# EAGLE design 6WP_arduino_DFPlayer (EAGLE 9.4.0)
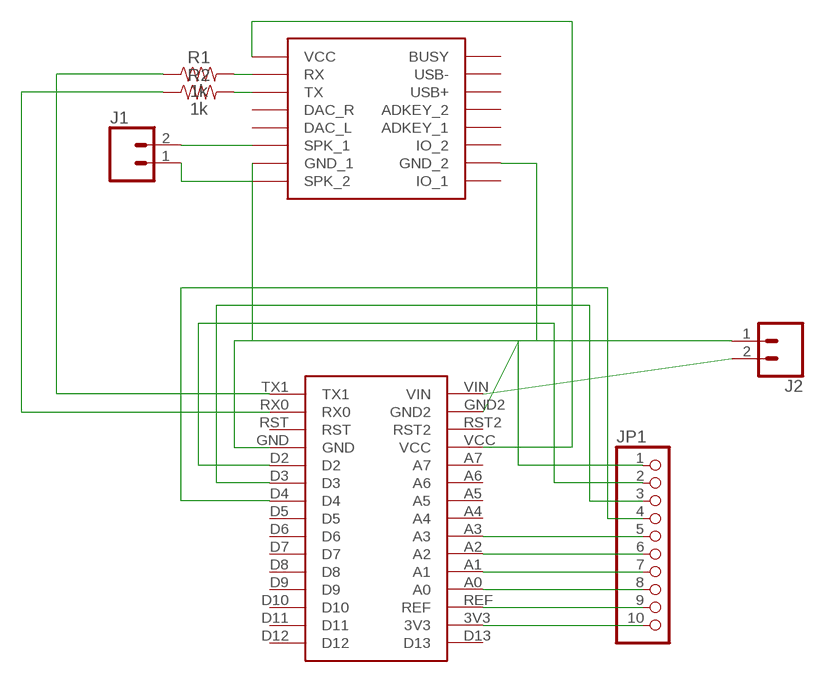
[diagram p0: schematic, sheet 1]

## Parts
A3  ARDUINONANO  [ARDUINONANO]
J1  CONN_02JST-PTH-2  [JST-2-PTH]
J2  CONN_02JST-PTH-2  [JST-2-PTH]
JP1  PINHD-1X10/90  [1X10/90]
R1  1k  1KOHM-HORIZ-1/4W-1%  [AXIAL-0.3]
R2  1k  1KOHM-HORIZ-1/4W-1%  [AXIAL-0.3]
U$1  DFPLAYER  [DFPLAYER]

## Nets
3V3: A3.3V3 JP1.10
A0: A3.A0 JP1.8
A1: A3.A1 JP1.7
A2: A3.A2 JP1.6
A3: A3.A3 JP1.5
D2: A3.D2 JP1.2
D3: A3.D3 JP1.3
D4: A3.D4 JP1.4
GND: A3.GND A3.GND2 J2.1 JP1.1 U$1.GND_1 U$1.GND_2
N$2: J1.2 U$1.SPK1(SPK_1)
N$3: J1.1 U$1.SPK2(SPK_2)
N$4: A3.VIN J2.2
N$16: R1.P$2 U$1.RX
N$21: A3.RX0 R2.P$1
N$22: A3.TX1 R1.P$1
N$23: R2.P$2 U$1.TX
N$27: A3.VCC U$1.VCC
REF: A3.REF JP1.9
Unconnected: A3.A4 A3.A5 A3.A6 A3.A7 A3.D5 A3.D6 A3.D7 A3.D8 A3.D9 A3.D10 A3.D11 A3.D12 A3.D13 A3.RST A3.RST2 U$1.ADKEY1(ADKEY_1) U$1.ADKEY2(ADKEY_2) U$1.BUSY U$1.DAC_L U$1.DAC_R U$1.IO1(IO_1) U$1.IO2(IO_2) U$1.USB+ U$1.USB-

## Library data of the parts
A3 = Arduino Nano:ARDUINONANO
J1 J2 = SparkFun-Connectors:CONN_02: Multi connection point. Often used as Generic Header-pin footprint for 0.1 inch spaced/style header connections On any of the 0.1 inch spaced packages, you can populate with these: Break Away Headers - Straight <https://www.sparkfun.com/products/116> (PRT-00116) Break Away Male Headers - Right Angle <https://www.sparkfun.com/products/553> (PRT-00553) Female Headers <https://www.sparkfun.com/products/115> (PRT-00115) Break Away Headers - Machine Pin <https://www.sparkfun.com/products/117> (PRT-00117) Break Away Female Headers - Swiss Machine Pin <https://www.sparkfun.com/products/743> (PRT-00743) For SCREWTERMINALS and SPRING TERMINALS visit here: Screw Terimnals on SparkFun.com <https://www.sparkfun.com/search/results?term=Screw+Terminals> (5mm/3.5mm/2.54mm spacing) This device is also useful as a general connection point to wire up your design to another part of your project. Our various solder wires solder well into these plated through hole pads. Hook-Up Wire - Assortment (Stranded, 22 AWG) <https://www.sparkfun.com/products/11375> (PRT-11375) Hook-Up Wire - Assortment (Solid Core, 22 AWG) <https://www.sparkfun.com/products/11367> (PRT-11367) View the entire wire category on our website here <https://www.sparkfun.com/categories/141> Special notes: Molex polarized connector foot print use with: PRT-08233 with associated crimp pins and housings. 2.54_SCREWTERM for use with PRT-10571. 3.5mm Screw Terminal footprints for PRT-08084 5mm Screw Terminal footprints for use with PRT-08432; PROD_ID: CONN-09863; SKU: PRT-09914
JP1 = pinhead:PINHD-1X10: PIN HEADER
R1 R2 = SparkFun-Resistors:1KOHM: 1kΩ resistor A resistor is a passive two-terminal electrical component that implements electrical resistance as a circuit element. Resistors act to reduce current flow, and, at the same time, act to lower voltage levels within circuits. - Wikipedia; PROD_ID: RES-12182
U$1 = DFPlayer_v1:DFPLAYER

## Board
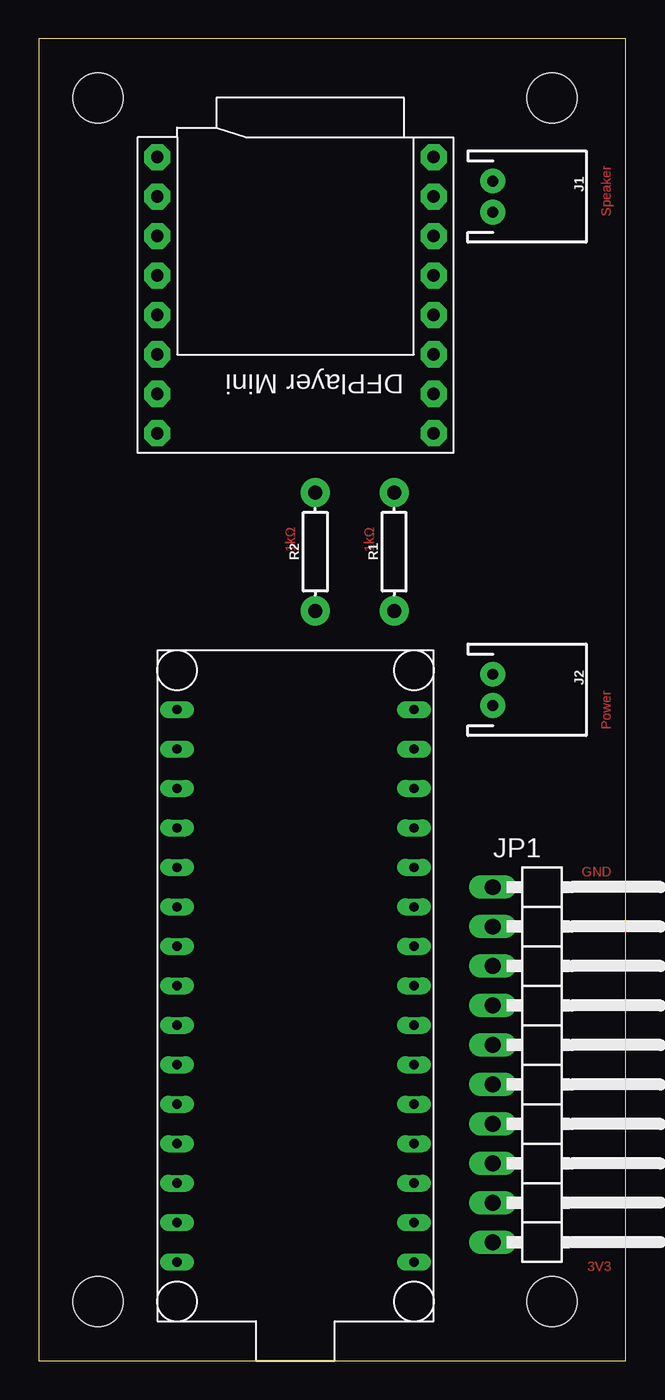
[diagram p1: board, top side]
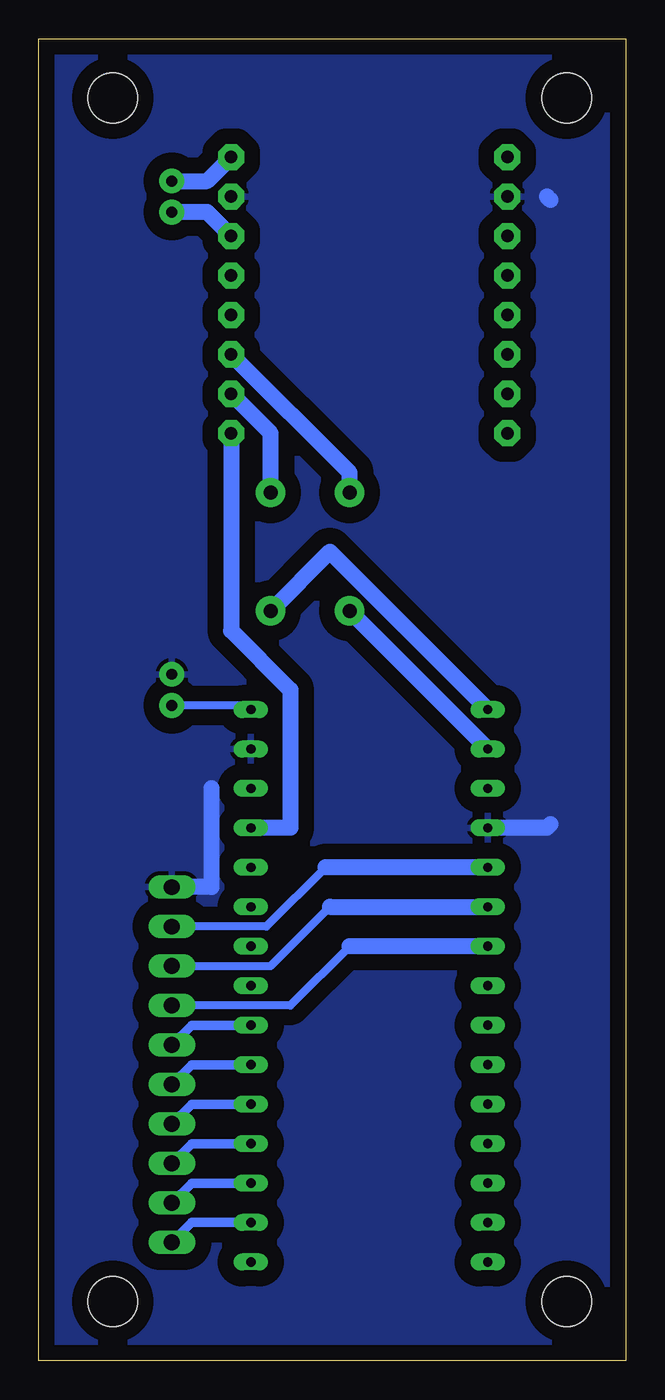
[diagram p2: board, bottom side, seen from below]

Size 37.77 x 85.08 mm. Coordinates in mm from the lower left corner, seen from the top.
Outline: 0,0 37.77,0 37.77,85.08 0,85.08 0,0
Copper layers (1*16): Top 0.035mm / dielectric 1.5mm / Bottom 0.035mm
Design rules "default": minimum track width 6mil, minimum drill 0.35mm, track to track 6mil, track to pad 6mil, pad to pad 6mil, via to via 6mil, smd to smd 6mil, copper to edge 40mil, drill to drill 6mil, minimum pad ring 10mil, minimum via ring 8mil, stop-mask expansion 4mil, vias tented up to drill 0mil, thermal gap 10mil
Holes 3.2 mm at 3.81,81.28 3.81,3.81 33.02,81.28 33.02,3.81

### Footprints (pad centres in the part's own frame; a part is rotated, then mirrored left to right if it is on the bottom)
ARDUINONANO = drill 0.6 long: 3V3 7.62,-16.51; A0 7.62,-11.43; A1 7.62,-8.89; A2 7.62,-6.35; A3 7.62,-3.81; A4 7.62,-1.27; A5 7.62,1.27; A6 7.62,3.81; A7 7.62,6.35; D2 -7.62,6.35; D3 -7.62,3.81; D4 -7.62,1.27; D5 -7.62,-1.27; D6 -7.62,-3.81; D7 -7.62,-6.35; D8 -7.62,-8.89; D9 -7.62,-11.43; D10 -7.62,-13.97; D11 -7.62,-16.51; D12 -7.62,-19.05; D13 7.62,-19.05; GND -7.62,8.89; GND2 7.62,13.97; REF 7.62,-13.97; RST -7.62,11.43; RST2 7.62,11.43; RX0 -7.62,13.97; TX1 -7.62,16.51; VCC 7.62,8.89; VIN 7.62,16.51
JST-2-PTH = drill 0.7 pad 1.6: 1 -1,0; 2 1,0
1X10/90 = drill 1.016 long: 1 -11.43,-3.81; 2 -8.89,-3.81; 3 -6.35,-3.81; 4 -3.81,-3.81; 5 -1.27,-3.81; 6 1.27,-3.81; 7 3.81,-3.81; 8 6.35,-3.81; 9 8.89,-3.81; 10 11.43,-3.81
AXIAL-0.3 = drill 0.9 pad 1.88: P$1 -3.81,0; P$2 3.81,0
DFPLAYER = drill 0.8 pad 1.676 octagon: ADKEY1 8.89,-1.27; ADKEY2 8.89,1.27; BUSY 8.89,8.89; DAC_L -8.89,-1.27; DAC_R -8.89,1.27; GND_1 -8.89,-6.35; GND_2 8.89,-6.35; IO1 8.89,-8.89; IO2 8.89,-3.81; RX -8.89,6.35; SPK1 -8.89,-3.81; SPK2 -8.89,-8.89; TX -8.89,3.81; USB+ 8.89,3.81; USB- 8.89,6.35; VCC -8.89,8.89

### Placement (x,y rotation side)
A3  16.51,25.4 0 top
J1  29.21,74.93 270 top
J2  29.21,43.18 270 top
JP1  33.02,19.05 270 top
R1  22.86,52.07 90 top
R2  17.78,52.07 90 top
U$1  16.51,68.58 180 top

### Tracks (layer width: path | path; a pad name or v marks a point on that pad's centre or on a via)
3V3
  Bottom 0.61: A3.3V3 27.94,8.89 JP1.10
A0
  Bottom 0.61: A3.A0 27.94,13.97 JP1.8
A1
  Bottom 0.61: A3.A1 27.94,16.51 JP1.7
A2
  Bottom 0.61: A3.A2 27.94,19.05 JP1.6
A3
  Bottom 0.61: A3.A3 27.94,21.59 JP1.5
D2
  Bottom 0.508: 19.32,31.75 23.13,27.94 JP1.2
  Bottom 1.016: A3.D2 19.32,31.75
D3
  Bottom 0.508: JP1.3 22.86,25.4 19.05,29.21
  Bottom 1.016: 19.05,29.21 A3.D3
D4
  Bottom 0.508: 17.78,26.67 21.59,22.86 JP1.4
  Bottom 1.016: A3.D4 17.78,26.67
GND
  Bottom 1.016: 5.08,74.93 4.85,74.7 | 4.85,34.52 5.08,34.29 A3.GND | 26.67,36.83 26.67,30.48 JP1.1
  pour Bottom (isolate 1.016): 0,85.09 38.1,85.09 38.1,0 0,0
N$2
  Bottom 1.016: U$1.SPK1 26.94,73.93 J1.2
N$3
  Bottom 1.016: J1.1 26.94,75.93 U$1.SPK2
N$4
  Bottom 0.508: A3.VIN 24.13,42.18 J2.2
N$16
  Bottom 1.016: R1.P$2 22.86,59.69 U$1.RX
N$21
  Bottom 1.016: R2.P$1 A3.RX0
N$22
  Bottom 1.016: A3.TX1 19.05,52.07 R1.P$1
N$23
  Bottom 1.016: U$1.TX 17.78,57.15 R2.P$2
N$27
  Bottom 1.016: U$1.VCC 25.4,46.99 21.59,43.18 21.59,34.29 A3.VCC
REF
  Bottom 0.61: A3.REF 27.94,11.43 JP1.9

### Text on the board
Top: Speaker | 1kΩ | 1kΩ | Power | GND | 3V3